# Altium schematic sheet Sheet1.SchDoc: Наименование
size 420 x 297 mm; ApprovedBy: Утвердил; CheckedBy: Проверил; Author: Разработал; CompanyName: Организация; DrawnBy: Н.Контр; Engineer: Т.Контр; SheetNumber: 1; SheetTotal: 1; PageSetup: Record=PageOptions|CenterHorizontal=True|CenterVertical=True|PrintScale=0.94|XCorrection=1.00|YCorrection=1.00|PrintKind=1|BorderSize=5000000|LeftOffset=0|BottomOffset=0|Orientation=1|PaperLength=1000|PaperWidth=1000|Scale=100|PaperSource=7|PrintQuality=-4|MediaType=1|DitherType=10|PaperKind=A4|PrintScaleMode=1; DecimalNumber: Децимальный номер; HeadOfSector: Нач. сектора; MainDevice: Перв.примен.; Name: Наименование; DocumentName: Sheet1.SCHDOC
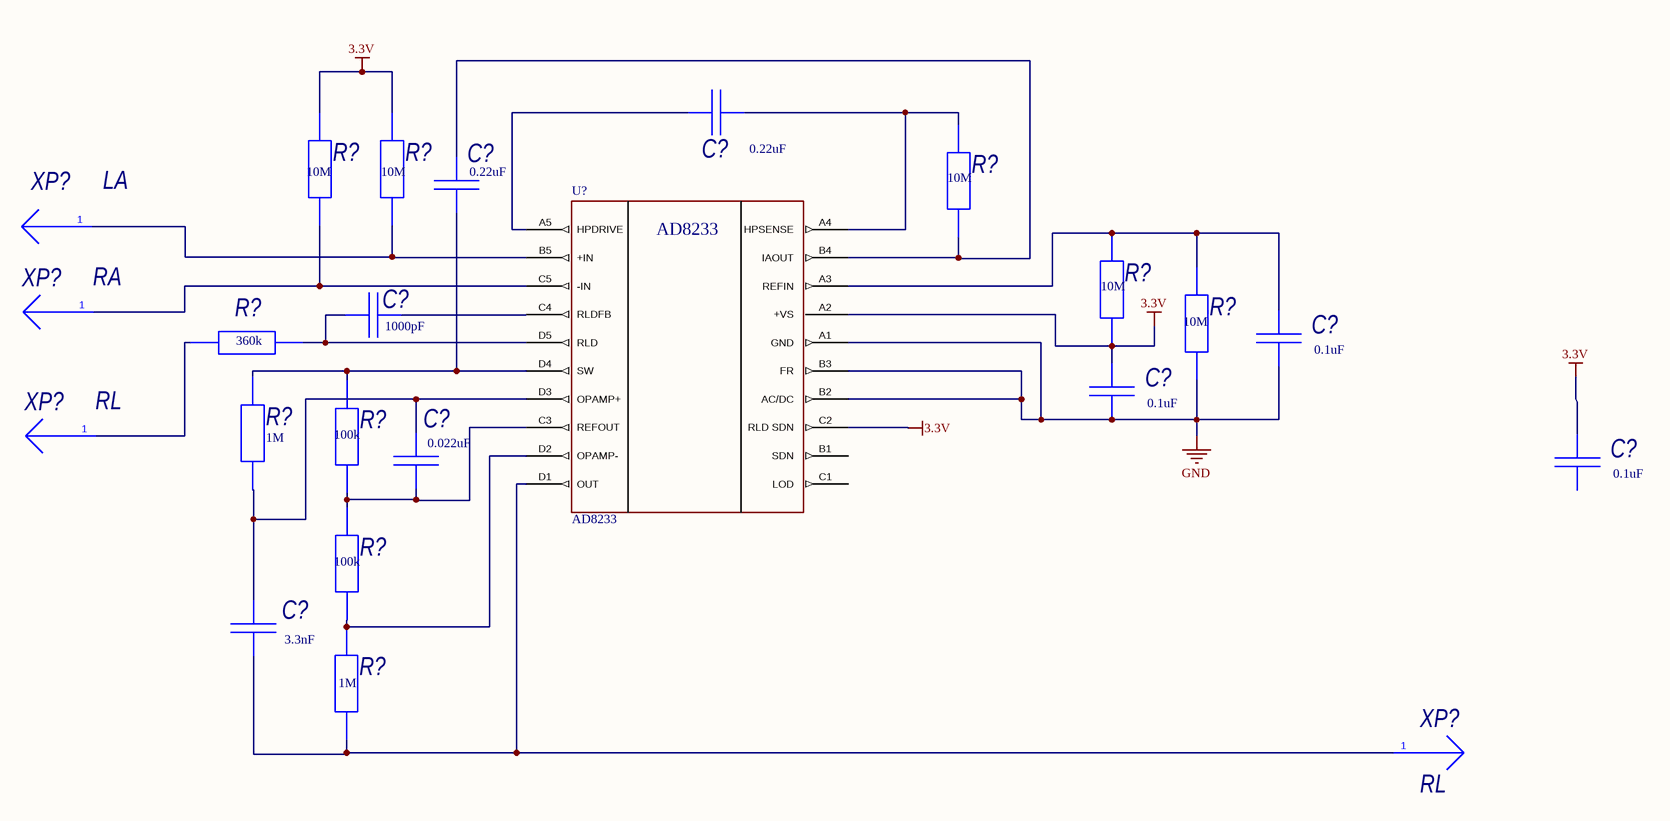
[diagram p0: Sheet1.SchDoc]

## Parts
(Parts that share a designator on the sheet are numbered #1, #2 ... from top to bottom, then left to right.)
C?#1  value 0.22uF  [C0402]  (hidden comment: Capacitor)
C?#2  value 0.22uF  [C0402]  (hidden comment: Capacitor)
C?#3  value 1000pF  [C0402]  (hidden comment: Capacitor)
C?#4  value 0.1uF  [C0402]  (hidden comment: Capacitor)
C?#5  value 0.1uF  [C0402]  (hidden comment: Capacitor)
C?#6  value 0.022uF  [C0402]  (hidden comment: Capacitor)
C?#7  value 0.1uF  [C0402]  (hidden comment: Capacitor)
C?#8  value 3.3nF  [C0402]  (hidden comment: Capacitor)
R?#1  value 10M  [R0603]  (hidden comment: Resistor)
R?#2  value 10M  [R0603]  (hidden comment: Resistor)
R?#3  value 10M  [R0603]  (hidden comment: Resistor)
R?#4  value 10M  [R0603]  (hidden comment: Resistor)
R?#5  value 10M  [R0603]  (hidden comment: Resistor)
R?#6  value 360k  [R0603]  (hidden comment: Resistor)
R?#7  value 1M  [R0603]  (hidden comment: Resistor)
R?#8  value 100k  [R0402]  (hidden comment: Resistor)
R?#9  value 100k  [R0402]  (hidden comment: Resistor)
R?#10  value 1M  [R0603]  (hidden comment: Resistor)
U?  AD8233  [WLCSP]
XP?#1  LA  [PLS-1RR]
XP?#2  RA  [PLS-1RR]
XP?#3  RL  [PLS-1RR]
XP?#4  RL  [PLS-1RR]

## Nets
3.3V: C?#5.2 C?#7.2 R?#1.2 R?#2.2 R?#4.1 U?.A2(+VS) U?.C2(RLD_SDN)
GND: C?#4.1 C?#5.1 R?#5.1 U?.A1(GND) U?.B2(AC/DC) U?.B3(FR)
NetC?#1_1: C?#1.1 U?.A5(HPDRIVE)
NetC?#1_2: C?#1.2 R?#3.2 U?.A4(HPSENSE)
NetC?#2_1: C?#2.1 R?#3.1 U?.B4(IAOUT)
NetC?#2_2: C?#2.2 R?#7.1 R?#8.2 U?.D4(SW)
NetC?#3_1: C?#3.1 R?#6.2 U?.D5(RLD)
NetC?#3_2: C?#3.2 U?.C4(RLDFB)
NetC?#4_2: C?#4.2 R?#4.2 R?#5.2 U?.A3(REFIN)
NetC?#6_1: C?#6.1 R?#8.1 R?#9.2 U?.C3(REFOUT)
NetC?#6_2: C?#6.2 C?#8.2 R?#7.2 U?.D3(OPAMP+)
NetC?#8_1: C?#8.1 R?#10.2 U?.D1(OUT) XP?#4.1
NetR?#1_1: R?#1.1 U?.C5(-IN) XP?#2.1
NetR?#2_1: R?#2.1 U?.B5(+IN) XP?#1.1
NetR?#6_1: R?#6.1 XP?#3.1
NetR?#9_1: R?#9.1 R?#10.1 U?.D2(OPAMP-)

Not connected (* = marked no-connect by the designer): C?#7 1; U? B1 (SDN_) C1 (LOD_)

## Notes on the sheet
- Перв.примен.
- Справ.№
- Подп. и дата
- Инв.№ дубл.
- Взам.инв.№
- Подп.и дата
- Разраб.
- Изм.
- Лист
- № докум.
- Подп.
- Дата
- Лит.
- Масштаб
- Масса
- Т.контр.
- Пров.
- СХЕМА   ЭЛЕКТРИЧЕСКАЯ
- ПРИНЦИПИАЛЬНАЯ
- Листов
- Инв.№ подл.
- Утв.
- Н.контр.
- Нач.сект.
- Формат  A3

## Library data of the parts
C?#1 C?#2 = GRM155R71C224KA12D: Manufacturer: Murata; Type: Конденсатор; ID: 177; Voltage: 16V; Tolerance: ±10%; Dielectric Type: X5R; Application Category: 1; Working Temperature Min: -55°С; Working Temperature Max: +125°С; Published: 18.05.2010; Publisher: Andrew Danich; Part Number: GRM155R71C224KA12D; Footprint: 0402
C?#3 = GRM155R71H102KA01D: Manufacturer: Murata; Type: Конденсатор; ID: 202; Voltage: 50V; Tolerance: ±10%; Dielectric Type: X7R; Application Category: 1; Working Temperature Min: -55°С; Working Temperature Max: +125°С; Published: 18.05.2010; Publisher: Andrew Danich; Part Number: GRM155R71H102KA01D; Footprint: 0402
C?#4 C?#5 C?#7 = GRM155R71C104KA88D: Manufacturer: Murata; Type: Конденсатор; ID: 163; Voltage: 16V; Tolerance: ±10%; Dielectric Type: X7R; Published: 18.05.2010; Publisher: Andrew Danich; Part Number: GRM155R71C104KA88D; Footprint: 0402
C?#6 = GRM155R71C223KA01D: Manufacturer: Murata; Type: Конденсатор; ID: 170; Voltage: 16V; Tolerance: ±10%; Dielectric Type: X7R; Published: 18.05.2010; Publisher: Andrew Danich; Part Number: GRM155R71C223KA01D; Footprint: 0402
C?#8 = GRM155R71H332KA01D: Manufacturer: Murata; Type: Конденсатор; ID: 166; Voltage: 50V; Tolerance: ±10%; Dielectric Type: X7R; Application Category: 1; Working Temperature Min: -55°С; Working Temperature Max: +125°С; Published: 18.05.2010; Publisher: Andrew Danich; Part Number: GRM155R71H332KA01D; Footprint: 0402
R?#1-R?#5 = RC0603FR-0710ML: Manufacturer: Yageo; ID: 397; Limit Voltage: 50V; Tolerance: ±1%; Temperature Coefficient: 100ppm; Total Power Dissipation: 0.1W; Series Type: Thick-Film; Application Category: 1; Working Temperature Min: -55°С; Working Temperature Max: +155°С; Published: 24.03.2010; Publisher: Andrew Danich; Type: Резистор; Part Number: RC0603FR-0710ML; Footprint: 0603
R?#6 = RC0603JR-07360KL: Manufacturer: Yageo; ID: 48; Limit Voltage: 50V; Tolerance: ±5%; Temperature Coefficient: 100ppm; Total Power Dissipation: 0.1W; Series Type: Thick-Film; Application Category: 1; Working Temperature Min: -55°С; Working Temperature Max: +155°С; Published: 24.03.2010; Publisher: Andrew Danich; Type: Резистор; Part Number: RC0603JR-07360KL; Footprint: 0603
R?#7 R?#10 = RC0603JR-071ML: Manufacturer: Yageo; ID: 20; Limit Voltage: 50V; Tolerance: ±5%; Temperature Coefficient: 100ppm; Total Power Dissipation: 0.1W; Series Type: Thick-Film; Application Category: 1; Working Temperature Min: -55°С; Working Temperature Max: +155°С; Published: 24.03.2010; Publisher: Andrew Danich; Type: Резистор; Part Number: RC0603JR-071ML; Footprint: 0603
R?#8 R?#9 = RC0402FR-07100KL: Manufacturer: Yageo; ID: 1; Limit Voltage: 50V; Tolerance: ±1%; Temperature Coefficient: 100ppm; Total Power Dissipation: 0.1W; Series Type: Thick-Film; Working Temperature Min: -55°С; Working Temperature Max: +155°С; Published: 24.03.2010; Publisher: Andrew Danich; Type: Резистор; Part Number: RC0402FR-07100KL; Footprint: 0402; Application Category: 1
XP?#1-XP?#4 = СНП346-1ВП32-1-В: Manufacturer: ОАО "Карачевский Завод "Электродеталь"; Specification: РЮМК.430420.011 ТУ; ID: 30; Limit Voltage: 250V; Limit Current: 1A; Connector Type: Male; Resistance: 15mohm; Surface Finish: Silver; Pitch: 2.54mm; Application Category: 5; Working Temperature Min: -60°С; Working Temperature Max: +85°С; Functional Analog: PLS-1R; Value: СНП346-1ВП32-1-В; Published: 07.03.2013; Publisher: Andrew Danich; Type: Вилка; Part Number: СНП346-1ВП32-1-В; Pins: 1